# EasyEDA Pro project DreamFly.eprj, board PCB1
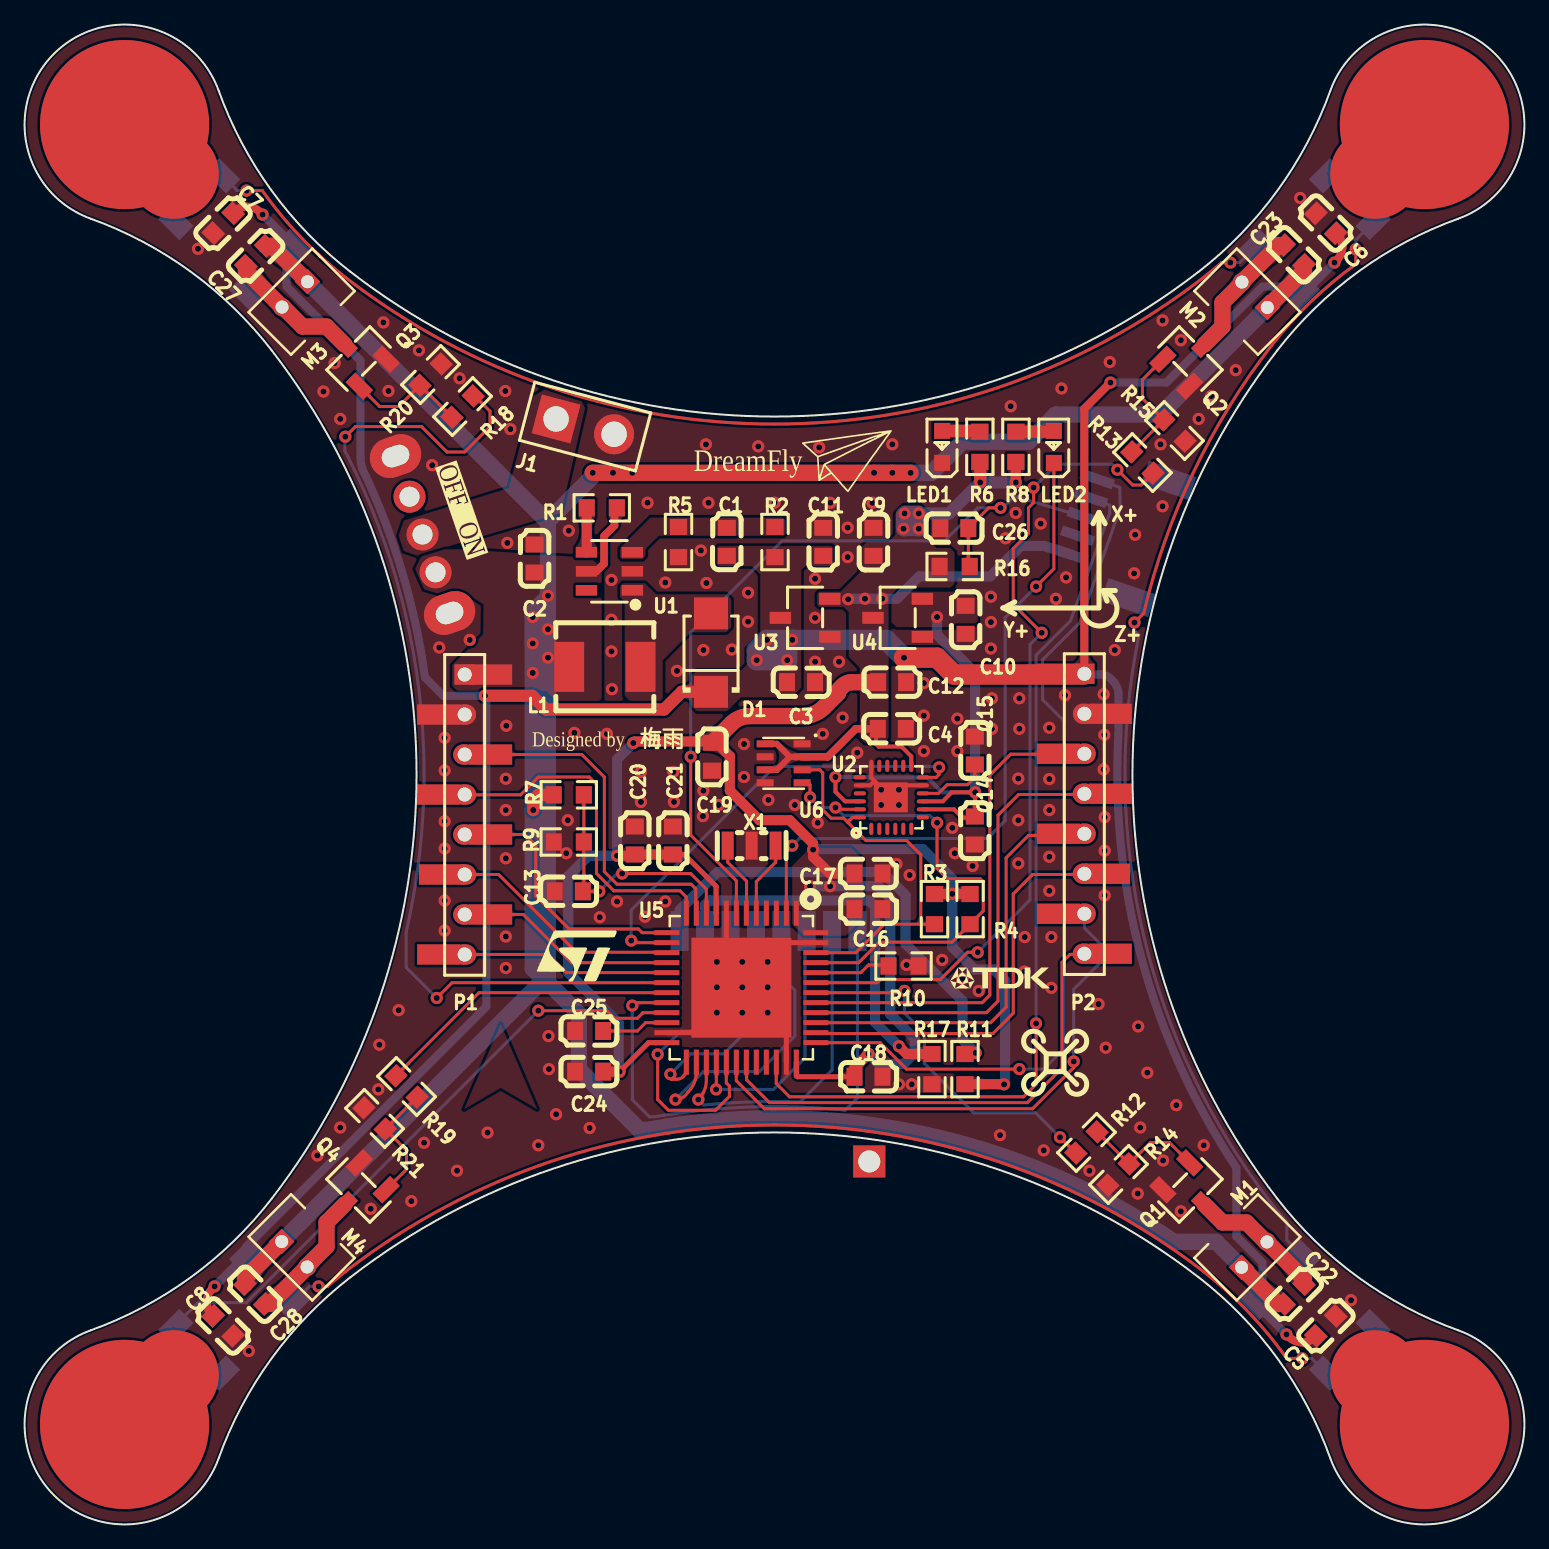
[diagram p4: board, top side]
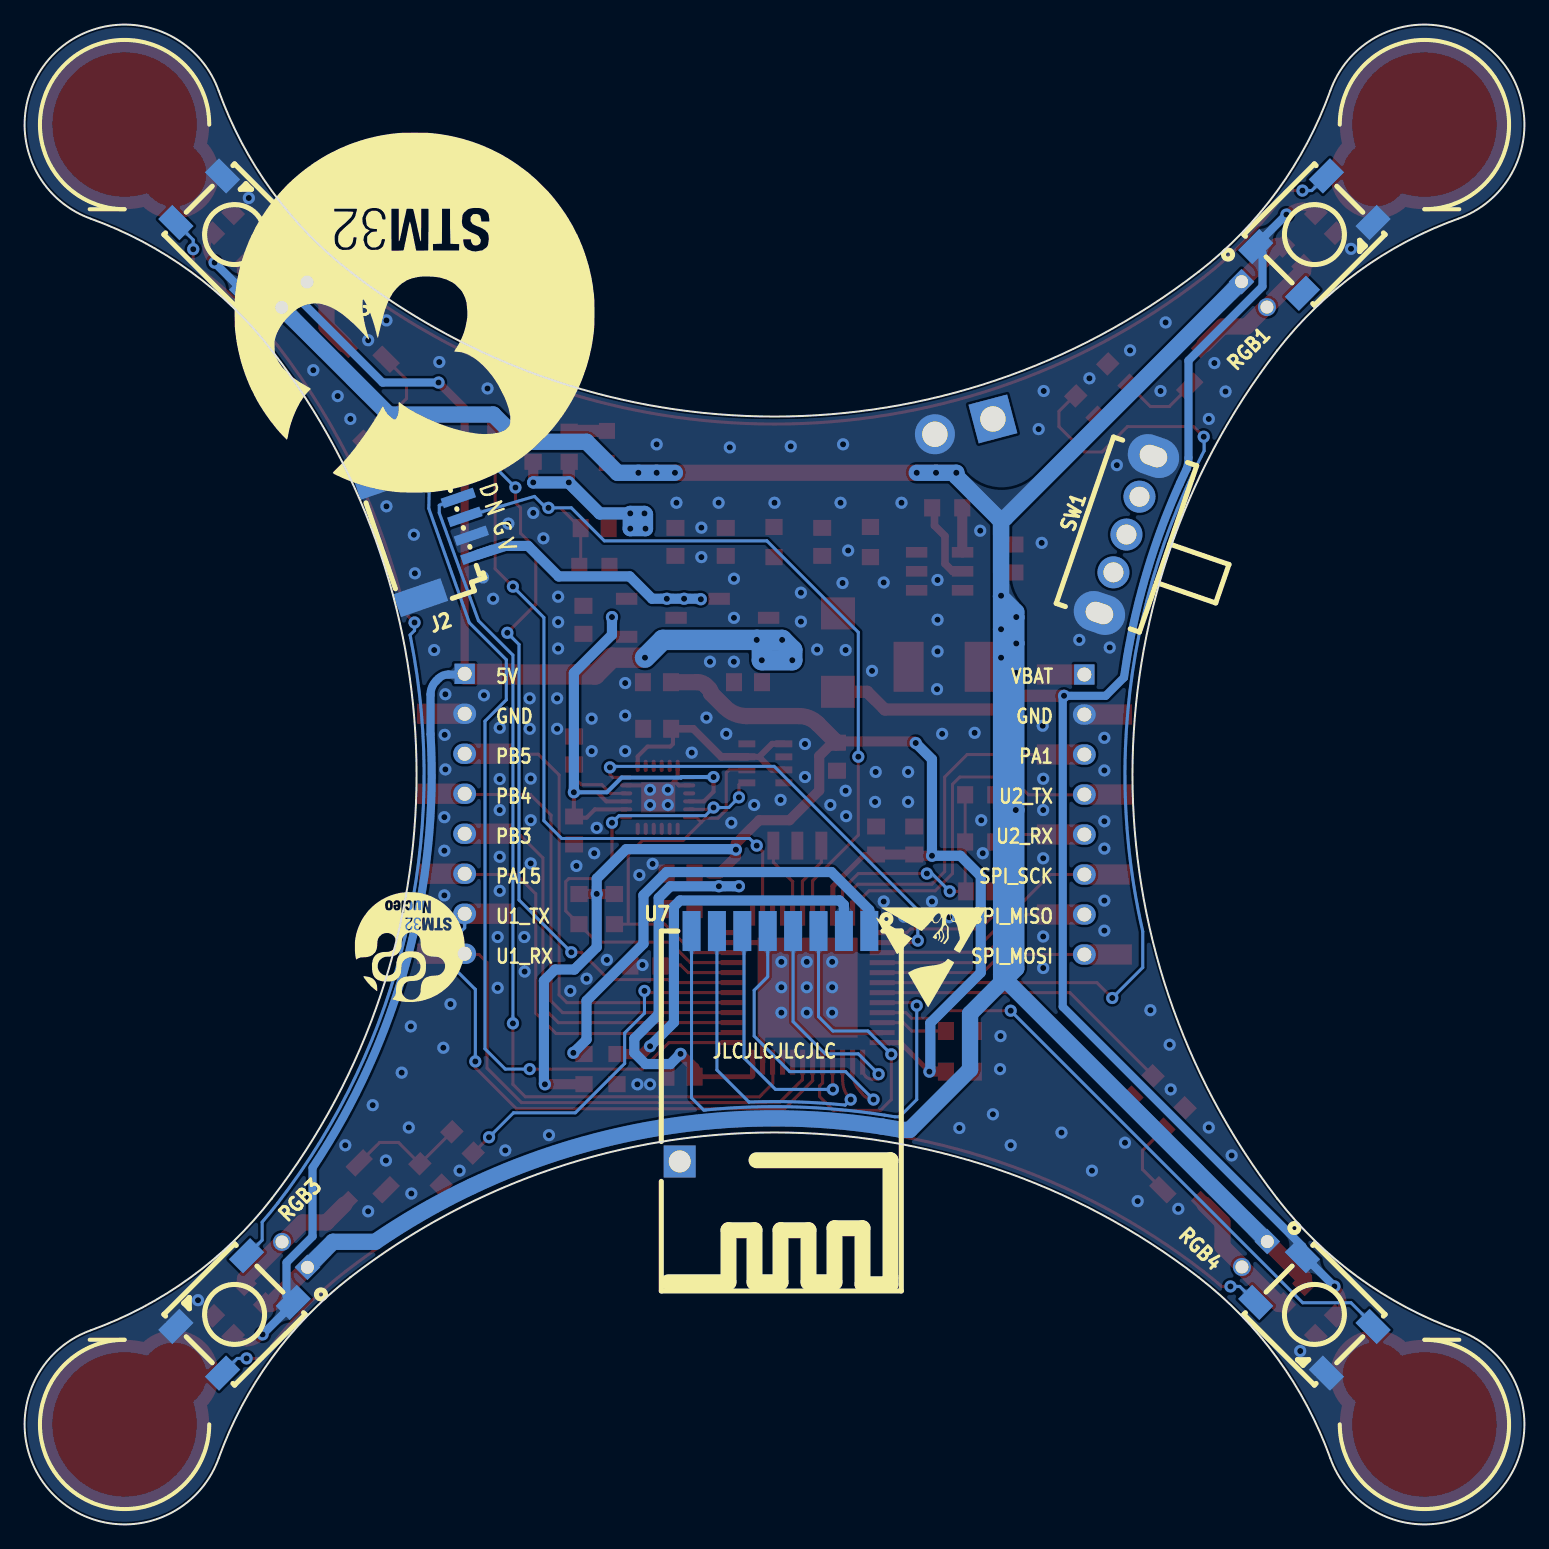
[diagram p5: board, bottom side, seen from below]

Outline 72.07 x 72.07 mm; copper layers: Top Layer, Bottom Layer. Coordinates in mm from the lower left corner of the outline.
Outline path: 1.84,63.83 arc(0,72.07) 8.24,70.23 arc(10.89,65.23) 14.83,61.18 arc(36.04,53.94) 57.24,61.18 arc(61.18,65.23) 63.83,70.23 arc(72.07,72.07) 70.23,63.83 arc(65.23,61.18) 61.18,57.24 arc(53.94,36.04) 61.18,14.83 arc(65.23,10.89) 70.23,8.24 arc(72.07,0) 63.83,1.84 arc(61.18,6.84) 57.24,10.9 arc(36.04,18.14) 14.83,10.9 arc(10.89,6.84) 8.24,1.84 arc(0,0) 1.84,8.24 arc(6.84,10.89) 10.9,14.83 arc(18.14,36.04) 10.9,57.24 arc(6.84,61.18) 1.84,63.83
Stack: Top Layer 0.035mm - / Dielectric1 1.51mm FR4 er 4.5 / Bottom Layer 0.035mm -

## Design rules (mm)
template: 自定义配置
spacing copperThickness1oz (default): track to track 0.102, other pairs 0 to 0.3
spacing copperThickness2oz: track to track 0.203, other pairs 0.152 to 0.3
track width copperThickness1oz (default): min 0.127, default 0.152, max 2.54
track width copperThickness2oz: min 0.203, default 0.254, max 2.54
differential pair differentialPair (default): width min 0.127, default 0.254, max 2.54; gap min 0.152, default 0.152
via viaSize (default): diameter min 0.5, default 0.61, max 10; hole min 0.3, default 0.305, max 6.299

## Placement (name value [footprint] x y rotation side)
C1  15pF  [C0603]  33.65 47.67 270 top
C2  22uF  [C0603]  24.04 46.84 270 top
C3  22uF  [C0603]  37.36 40.65 180 top
C4  100nF  [C0603]  41.9 38.32 0 top
C5  100nF  [C0603]  63.6 8.47 225 top
C6  100nF  [C0603]  63.6 63.6 315 top
C7  100nF  [C0603]  8.47 63.6 45 top
C8  100nF  [C0603]  8.47 8.47 135 top
C9  1uF  [C0603]  40.99 47.67 90 top
C10  1uF  [C0603]  45.59 43.77 270 top
C11  1uF  [C0603]  38.47 47.67 90 top
C12  1uF  [C0603]  41.92 40.65 0 top
C13  100nF  [C0603]  25.75 30.19 0 top
C14  100nF  [C0603]  46.05 33.24 90 top
C15  100nF  [C0603]  46.05 37.24 270 top
C16  100nF  [C0603]  40.73 29.3 180 top
C17  100nF  [C0603]  40.73 31.08 0 top
C18  100nF  [C0603]  40.73 20.92 180 top
C19  100nF  [C0603]  32.91 36.92 90 top
C20  4.7uF  [C0603]  29.05 32.73 90 top
C21  100nF  [C0603]  30.96 32.73 90 top
C22  100nF  [C0603]  62.02 10.05 225 top
C23  100nF  [C0603]  62.02 62.02 315 top
C24  100nF  [C0603]  26.76 21.18 0 top
C25  4.7uF  [C0603]  26.76 23.21 0 top
C26  100nF  [C0603]  45.03 48.35 0 top
C27  100nF  [C0603]  10.1 61.97 45 top
C28  100nF  [C0603]  10.05 10.05 135 top
D1  SS14F  [SMAF_L3.5-W2.6-LS4.7-RD]  32.86 42.13 90 top
J1  -  [BAT]  25.11 53.82 345.2 top
J2  SH1.0-5P_WT  [CONN-SMD_5P-P1.00_BX-SH1.0-5PWT]  53.13 48.37 251 bottom
L1  4.7uH  [IND-SMD_L4.9-W4.4_MAPM0420F]  27.55 41.42 0 top
LED1  NCD1608R1  [LED0603-RD_RED]  44.42 52.42 90 top
LED2  NCD1608A1  [LED0603-RD]  50.01 52.42 90 top
M1  720_MOTOR  [motor]  60.04 12.04 45 top
M2  720_MOTOR  [motor]  60.04 60.04 135 top
M3  720_MOTOR  [motor]  12.04 60.04 225 top
M4  720_MOTOR  [motor]  12.04 12.04 315 top
NOREF  -  [Pad_e109]  68.54 3.54 90 top
NOREF#2  -  [Pad_e112]  6 6 0 top
NOREF#3  -  [Pad_e114]  66.07 66.07 180 top
NOREF#4  -  [Pad_e107]  3.54 68.54 270 top
NOREF#5  -  [Pad_e111]  3.54 3.54 0 top
NOREF#6  -  [Pad_e113]  68.54 68.54 180 top
NOREF#7  -  [Pad_e108]  6 66.07 270 top
NOREF#8  -  [Pad_e110]  66.07 6 90 top
P1  -  [header10-2.0mm]  20.54 34.04 270 top
P2  -  [header10-2.0mm#2]  51.53 34.04 90 top
Q1  SI2302  [SOT-23-3_L2.9-W1.3-P1.90-LS2.4-BR]  56.84 15.24 135 top
Q2  SI2302  [SOT-23-3_L2.9-W1.3-P1.90-LS2.4-BR]  56.84 56.84 225 top
Q3  SI2302  [SOT-23-3_L2.9-W1.3-P1.90-LS2.4-BR]  15.24 56.84 315 top
Q4  SI2302  [SOT-23-3_L2.9-W1.3-P1.90-LS2.4-BR]  15.24 15.24 45 top
R1  100kΩ  [R0603]  27.4 49.37 0 top
R2  73.2kΩ  [R0603]  36.06 47.66 270 top
R3  10kΩ  [R0603]  44.04 29.3 90 top
R4  10kΩ  [R0603]  45.81 29.3 90 top
R5  10kΩ  [R0603]  31.24 47.66 90 top
R6  4.7kΩ  [R0603]  46.3 52.42 270 top
R7  100kΩ  [R0603]  25.75 35.02 0 top
R8  4.7kΩ  [R0603]  48.11 52.42 270 top
R9  100kΩ  [R0603]  25.75 32.66 180 top
R10  10kΩ  [R0603]  42.49 26.46 180 top
R11  0Ω  [R0603]  45.56 21.3 270 top
R12  100Ω  [R0603]  51.64 17.64 45 top
R13  100Ω  [R0603]  54.44 51.64 135 top
R14  10kΩ  [R0603]  53.24 16.04 45 top
R15  10kΩ  [R0603]  56.04 53.24 135 top
R16  10kΩ  [R0603]  45.04 46.44 180 top
R17  0Ω  [R0603]  43.91 21.3 90 top
R18  100Ω  [R0603]  20.44 54.44 225 top
R19  100Ω  [R0603]  17.64 20.44 315 top
R20  10kΩ  [R0603]  18.84 56.04 225 top
R21  10kΩ  [R0603]  16.04 18.84 315 top
RGB1  WS2812B  [LED-SMD_4P-L5.0-W5.0-BL_TC5050RGB]  9.04 63.04 135 bottom
RGB2  WS2812B  [LED-SMD_4P-L5.0-W5.0-BL_TC5050RGB]  63.04 63.04 45 bottom
RGB3  WS2812B  [LED-SMD_4P-L5.0-W5.0-BL_TC5050RGB]  63.04 9.04 315 bottom
RGB4  WS2812B  [LED-SMD_4P-L5.0-W5.0-BL_TC5050RGB]  9.04 9.04 225 bottom
SW1  SK12D07VG3  [SW-TH_SK12D07VG3]  18.44 48.04 109 bottom
U1  SX1308  [SOT-23-6_L2.9-W1.6-P0.95-LS2.8-BL]  27.78 46.2 90 top
U2  ICM20948  [qfn24-0.4]  41.88 34.89 90 top
U3  ME6206A33M3G  [SOT-23-3_L2.9-W1.6-P1.90-LS2.8-BR]  37.57 43.87 0 top
U4  XC6206P182MR  [SOT-23-3_L2.9-W1.6-P1.90-LS2.8-BR]  42.19 43.87 0 top
U5  STM32F411CEU6  [qfn48]  34.38 25.37 270 top
U6  BMP280  [LGA-2_5X2MM]  36.49 36.59 0 top
U7  2.4GHz  [WIRELM-SMD_AI-THINKER_NF-03]  36.04 22.45 0 bottom
X1  8MHz  [OSC-SMD_3P-L3.2-W1.3-P1.20-L]  34.89 32.48 180 top

## Footprints (pads in the part's own frame, mm; a bottom-side part is the same pattern mirrored in y, then rotated)
BAT
  rect 2x2 hole 1.27: 1(0,0)
  round 2 hole 1.27: 2(3,0)
C0603
  rect 0.8x0.9 smd: 1(-0.7,0) 2(0.7,0)
CONN-SMD_5P-P1.00_BX-SH1.0-5PWT
  rect 0.5x1.7 smd: 1(-2,1.7) 2(-1,1.7) 3(0,1.7) 4(1,1.7) 5(2,1.7)
  rect 1.2x2.5 smd: 6(3.1,-1.7) 7(-3.1,-1.7)
header10-2.0mm
  rect 1.016x2.159 smd: 1(-7,1.297) 2(-5,-1.297) 3(-2.999,1.297) 4(-1,-1.297) 5(1,1.297) 7(5,1.297) 8(7,-1.297)
  rect 1.016x1.016 hole 0.7: 1(-7,0)
  oval 1.016x1.143 hole 0.7: 2(-5,0) 3(-2.999,0) 4(-1,0) 5(1,0) 6(3.001,0) 7(5,0) 8(7,0)
  rect 1.016x2.286 smd: 6(3.001,-1.145)
header10-2.0mm#2
  rect 1.016x2.159 smd: 1(7.037,1.297) 2(5.037,-1.297) 3(3.037,1.297) 4(1.037,-1.297) 5(-0.963,1.297) 7(-4.963,1.297) 8(-6.963,-1.297)
  rect 1.016x1.016 hole 0.7: 1(7.037,0)
  oval 1.016x1.143 hole 0.7: 2(5.037,0) 3(3.037,0) 4(1.037,0) 5(-0.963,0) 6(-2.963,0) 7(-4.963,0) 8(-6.963,0)
  rect 1.016x2.286 smd: 6(-2.963,-1.145)
IND-SMD_L4.9-W4.4_MAPM0420F
  rect 1.5x2.5 smd: 1(-1.78,0) 2(1.78,0)
LED0603-RD
  rect 0.8x0.8 smd: 1(-0.799,0) 2(0.799,0)
LED0603-RD_RED
  rect 0.8x0.8 smd: 1(-0.799,-0.004) 2(0.799,0.004)
LED-SMD_4P-L5.0-W5.0-BL_TC5050RGB
  rect 1.5x1 smd: 1(-2.5,1.65) 2(-2.5,-1.65) 3(2.5,-1.65) 4(2.5,1.65)
LGA-2_5X2MM
  rect 0.85x0.35 smd: 1(0.925,0.975) 2(0.925,0.325) 3(0.925,-0.325) 4(0.925,-0.975) 5(-0.925,-0.975) 6(-0.925,-0.325) 7(-0.925,0.325) 8(-0.925,0.975)
motor
  rect 0.9x0.9 hole 0.65: 1(-0.911,0)
  round 0.9 hole 0.65: 2(0.886,0)
OSC-SMD_3P-L3.2-W1.3-P1.20-L
  rect 0.6x1.4 smd: 1(-1.199,0) 2(0,0) 3(1.199,0)
Pad_e107
  round 8.46 smd: 50(0,0)
Pad_e108
  round 4.5 smd: 1(0,0)
Pad_e109
  round 8.46 smd: 50(0,0)
Pad_e110
  round 4.5 smd: 1(0,0)
Pad_e111
  round 8.46 smd: 50(0,0)
Pad_e112
  round 4.5 smd: 1(0,0)
Pad_e113
  round 8.46 smd: 50(0,0)
Pad_e114
  round 4.5 smd: 1(0,0)
qfn24-0.4
  oval 0.61x0.203 smd: 1(-1.575,1) 2(-1.575,0.6) 3(-1.575,0.2) 4(-1.575,-0.2) 5(-1.575,-0.6) 6(-1.575,-1) 13(1.575,-1) 14(1.575,-0.6) 15(1.575,-0.2) 16(1.575,0.2) 17(1.575,0.6) 18(1.575,1)
  oval 0.203x0.61 smd: 7(-1,-1.575) 8(-0.6,-1.575) 9(-0.2,-1.575) 10(0.2,-1.575) 11(0.6,-1.575) 12(1,-1.575) 19(1,1.575) 20(0.6,1.575) 21(0.2,1.575) 22(-0.2,1.575) 23(-0.6,1.575) 24(-1,1.575)
  rect 1.5x1.7 smd: 25(0,0.025)
qfn48
  rect 1.25x0.25 smd: 1(-3.734,2.743) 2(-3.734,2.243) 3(-3.734,1.743) 4(-3.734,1.243) 5(-3.734,0.743) 6(-3.734,0.243) 7(-3.734,-0.257) 8(-3.734,-0.757) 9(-3.734,-1.257) 10(-3.734,-1.757) 11(-3.734,-2.257) 12(-3.734,-2.757) 25(3.716,-2.757) 26(3.716,-2.257) 27(3.716,-1.757) 28(3.716,-1.257) 29(3.716,-0.757) 30(3.716,-0.257) 31(3.716,0.243) 32(3.716,0.743) 33(3.716,1.243) 34(3.716,1.743) 35(3.716,2.243) 36(3.716,2.743)
  rect 0.25x1.25 smd: 13(-2.759,-3.732) 14(-2.259,-3.732) 15(-1.759,-3.732) 16(-1.259,-3.732) 17(-0.759,-3.732) 18(-0.259,-3.732) 19(0.241,-3.732) 20(0.741,-3.732) 21(1.241,-3.732) 22(1.741,-3.732) 23(2.241,-3.732) 24(2.741,-3.732) 37(2.741,3.718) 38(2.241,3.718) 39(1.741,3.718) 40(1.241,3.718) 41(0.741,3.718) 42(0.241,3.718) 43(-0.259,3.718) 44(-0.759,3.718) 45(-1.259,3.718) 46(-1.759,3.718) 47(-2.259,3.718) 48(-2.759,3.718)
  rect 5x5 smd: 49(-0.009,-0.007)
R0603
  rect 0.806x0.864 smd: 1(-0.753,0) 2(0.753,0)
SMAF_L3.5-W2.6-LS4.7-RD
  rect 1.6x1.7 smd: 1(-1.96,0) 2(1.96,0)
SOT-23-3_L2.9-W1.3-P1.90-LS2.4-BR
  rect 1.25x0.7 smd: 1(1,-0.95) 2(1,0.95) 3(-1,0)
SOT-23-3_L2.9-W1.6-P1.90-LS2.8-BR
  rect 1.07x0.6 smd: 1(1.235,-0.95) 2(1.235,0.95) 3(-1.235,0)
SOT-23-6_L2.9-W1.6-P0.95-LS2.8-BL
  rect 0.532x1.072 smd: 1(-0.95,-1.149) 2(0,-1.149) 3(0.95,-1.149) 4(0.95,1.149) 5(0,1.149) 6(-0.95,1.149)
SW-TH_SK12D07VG3
  oval 1.6x1.6 hole 1: 1(-2,0) 2(0,0) 3(2,0)
  oval 2x2.6 hole 1x1.4: 4(4.15,0) 5(-4.15,0)
WIRELM-SMD_AI-THINKER_NF-03
  rect 0.9x2 smd: 1(-4.74,-5.761) 2(-3.47,-5.761) 3(-2.2,-5.761) 4(-0.93,-5.761) 5(0.34,-5.761) 6(1.609,-5.761) 7(2.88,-5.761) 8(4.149,-5.761)
  rect 1.6x1.6 hole 1.1: 9(4.74,5.761)

## Nets
As in the schematic.

Pads without a net: NOREF 50; NOREF#2 1; NOREF#3 1; NOREF#4 50; NOREF#5 50; NOREF#6 50; NOREF#7 1; NOREF#8 1; RGB1 2; SW1 3; U1 6; U2 1 2 3 4 5 6 7 14 15 16 17 19 21; U5 3 4 32 33; U7 9

## Via types
v1: diameter 0.61, hole 0.305, Top Layer to Bottom Layer, 263 vias

## Routing (per net, layer and track width the routed paths; a pad name or vN(x,y) marks a point on that pad's centre or on a via; arc(x,y) is an arc through that point)
1V8: length 25.8
  Top Layer w0.203: U2.22 39.57,34.69 39.08,35.18 v1(39.08,35.91) ; U2.8 45.02,34.29 45.43,33.88 46,33.88 C14.2 46.07,33.95 v1(46.07,35.15) 44.9,35.15 44.45,34.69 U2.9
  Bottom Layer w0.203: v1(46.07,35.15) 44.42,35.15 43.68,35.88 40.71,35.88 40.68,35.91 v1(39.08,35.91)
  Bottom Layer w0.508: v1(44.16,43.91) 44.16,43.02 46.07,41.12 v1(46.07,35.15)
3V3: length 132
  Top Layer w0.203: 41.05,38.32 41.12,38.26 41.12,37.56 41.24,37.43 42.39,37.43 42.88,36.94 U2.13
  Top Layer w0.254: C18.2 37.18,20.92 37.13,20.97 U5.36 ; C21.1 31.53,32.03 33.11,30.45 33.11,29.11 U5.9 ; U5.24 29.74,22.63 v1(28.29,21.18)
  Top Layer w0.305: 36.8,36.92 36.15,36.27 35.54,36.27 ; 36.8,36.92 37.39,36.92 ; 36.8,36.92 36.15,37.57 35.54,37.57
  Top Layer w0.381: 37.39,36.92 38.7,36.92 40.1,38.32 41.05,38.32
  Top Layer w0.508: v1(28.16,31.97) 28.99,31.97 C20.1 C21.1 ; v1(28.97,37.61) 29.05,37.69 32.8,37.69 32.86,37.62 33.13,37.62 33.8,36.96 33.8,35.24 35.29,33.75 36.8,33.75 37.97,32.58 v1(37.97,32.28) 37.97,31.92 38.8,31.08 39.27,31.08 ; C24.2 v1(28.29,21.18) ; v1(47.52,20.54) 47.51,20.55 R11.2 ; R4.2 45.81,30.07 v1(44.93,30.07) 44.92,30.06 43.91,30.06 ; v1(40.73,22.07) 40.03,21.37 C18.2 ; v1(48.1,50.64) 48.1,51.66 R8.2
  Top Layer w0.61: R6.2 46.32,51.65 v1(46.32,50.64)
  Top Layer w0.813: 41.06,40.65 39.88,40.65 arc(39.65,40.61) 39.46,40.48 39.3,40.32 arc(39.23,40.22) 39.21,40.1 38.52,39.41 arc(38.02,39.07) 37.43,38.96 34.8,38.96 arc(34.3,38.86) 33.88,38.58 33.03,37.73 arc(32.99,37.68) 32.94,37.62
  Bottom Layer w0.508: v1(37.97,32.28) 37.99,32.3 43.45,32.3 44.93,30.83 v1(44.93,30.07) 44.93,27.4 46.04,26.28 47.01,26.28 47.57,25.72 47.57,20.59 v1(47.52,20.54) ; v1(28.97,37.61) 28.16,36.8 v1(28.16,31.97) 26.74,31.97 25.72,30.96 25.72,26.13 28.24,23.61 28.24,21.22 v1(28.29,21.18) ; v1(37.81,30.45) v1(38.82,30.45) 41.24,30.45 41.83,29.86 41.83,24.05 43.05,22.83 43.05,22.12 42.49,21.56 41.24,21.56 v1(40.73,22.07) ; J2.5 49.5,47.47 48.35,47.47 46.83,45.94 43.27,45.94 42.16,44.82 v1(41.42,44.82) v1(40.56,44.82) 39.74,44.82 v1(39.72,44.8)
  Bottom Layer w0.61: v1(43.25,49.09) 44.77,49.09 v1(46.32,50.64) v1(48.1,50.64)
  Bottom Layer w0.762: v1(42.54,49.09) v1(43.25,49.09) v1(43.25,48.33) v1(42.49,48.33) 42.49,49.04 v1(42.54,49.09)
5V: length 169.7
  Top Layer w0.406: v1(61.64,8.04) 61.75,7.92 arc(62.07,7.71) 62.44,7.64 arc(62.75,7.7) 63.01,7.87 C5.2 ; 51.53,41.04 51.53,54.33 v1(52.84,55.64) ; v1(8.04,10.44) 7.92,10.32 arc(7.71,10.01) 7.64,9.64 arc(7.7,9.32) 7.87,9.06 C8.2 ; C6.2 64.2,63.01 arc(64.37,62.75) 64.44,62.44 arc(64.36,62.07) 64.15,61.75 v1(64.04,61.64) ; v1(10.44,64.04) 10.32,64.15 arc(10.01,64.36) 9.64,64.44 arc(9.32,64.37) 9.06,64.2 C7.2
  Top Layer w0.61: v1(21.56,39.97) 23.92,39.97 24.61,39.29 30.52,39.29 31.4,40.17 D1.1
  Top Layer w1.016: v1(42.51,41.88) 44.16,41.88 45.01,41.04 51.53,41.04
  Bottom Layer w0.406: 51.53,41.04 52.35,41.04 arc(52.61,40.98) 52.84,40.84 52.95,40.72 arc(53.16,40.41) 53.24,40.04 53.24,38.06 arc(54.42,26.73) 59.14,16.37 59.14,12.94 60.44,11.64 60.44,9.97 60.1,9.64 arc(60.11,9.58) 60.15,9.52 v1(61.64,8.04) ; v1(52.84,55.64) 55.64,55.64 60.44,60.44 62.1,60.44 62.43,60.1 arc(62.5,60.11) 62.55,60.15 v1(64.04,61.64) ; v1(10.44,64.04) 11.92,62.55 arc(11.96,62.5) 11.97,62.43 11.64,62.1 11.64,60.44 15.33,56.74 15.33,51.87 arc(15.36,51.6) 15.42,51.34 arc(15.59,50.97) 15.76,50.6 arc(17.36,46.33) 18.41,41.88 arc(18.49,41.38) 18.56,40.89 19.47,39.97 v1(21.56,39.97) 21.62,39.91 21.62,24.42 9.64,12.44 9.64,11.97 arc(9.58,11.96) 9.52,11.92 v1(8.04,10.44)
  Bottom Layer w1.016: v1(36.92,42.77) 41.62,42.77 v1(42.51,41.88) ; v1(36.92,42.77) v1(35.65,42.77) 35.15,42.26 v1(35.15,41.75) v1(36.67,41.75) 36.67,42.51 v1(36.92,42.77)
GND: length 22.7
  Top Layer w0.203: U2.20 40.82,35.49 41.04,35.71 ; U2.18 40.88,35.87 41.04,35.71 ; 41.04,35.71 U2.25 42.45,35.49 U2.11
  Top Layer w0.254: U5.49 36.63,27.63 38.1,27.63 ; U5.49 36.63,23.13 U5.35 ; U5.49 32.13,23.13 U5.23 ; U5.49 33.63,26.13 U5.8
  vias: v1(7.21,62.32) v1(9.75,7.21) v1(13.18,16.99) v1(13.48,55.19) v1(14.04,56.61) v1(14.32,53.82) v1(14.32,18.38) v1(15.84,14.32) v1(16.27,22.52) v1(16.22,20.29) v1(16.48,58.64) v1(16.73,55.21) v1(17.24,24.25) v1(17.87,14.7) v1(18.26,57.24) v1(18.51,17.62) v1(18.92,51.5) v1(19.27,42.39) v1(19.54,37.87) v1(19.54,36.24) v1(19.54,33.7) v1(19.54,32.33) v1(19.54,29.73) v1(19.54,28.23) v1(20.16,16.22) v1(20.29,55.85) v1(20.8,42.77) v1(21.68,18.13) v1(22.57,55.21) v1(22.68,47.62) v1(22.62,38.47) v1(22.6,35.82) v1(22.6,34.26) v1(22.6,31.84) v1(22.6,27.93) v1(22.6,26.36) v1(22.83,53.31) v1(24.22,17.49) v1(24.73,22.95) v1(24.76,21.3) v1(25.11,19.05) v1(25.62,32.1) v1(25.75,48.23) v1(25.7,33.75) v1(26.03,38.12) v1(26.79,18.36) v1(27.3,28.9) v1(27.65,38.07) v1(27.88,45.76) v1(27.88,43.77) v1(27.88,42.19) v1(27.91,40.3) v1(28.16,29.69) v1(29.36,36.16) v1(29.36,34.66) v1(29.56,28.92) v1(29.69,49.62) v1(30.57,45.64) v1(30.57,29.69) v1(30.98,36.16) v1(31.01,34.66) v1(31.16,41.22) v1(32.35,47.24) v1(32.48,42.26) v1(32.48,35.22) v1(32.45,33.95) v1(32.61,52.55) v1(32.63,45.61) v1(32.73,49.62) v1(33.15,26.67) v1(33.15,25.4) v1(33.15,24.13) v1(33.24,34.51) v1(33.9,42.28) v1(34.42,26.67) v1(34.42,25.4) v1(34.42,24.13) v1(34.51,37.56) v1(34.51,35.91) v1(34.71,45.13) v1(34.71,43.68) v1(35.22,52.44) v1(35.73,34.77) v1(35.69,26.67) v1(35.69,25.4) v1(35.69,24.13) v1(36.04,49.62) v1(37.05,34.51) v1(38.06,45.83) v1(38.06,43.87) v1(38.07,41.67) v1(38.27,52.39) v1(38.19,33.62) v1(38.45,38.07) v1(38.83,49.62) v1(39.26,41.67) v1(39.44,38.88) v1(39.69,48.38) v1(39.69,46.91) v1(40.18,37.13) v1(40.94,49.62) v1(41.37,35.27) v1(41.37,34.51) v1(41.93,52.55) v1(42.13,31.57) v1(42.26,35.27) v1(42.26,34.51) v1(42.26,20.54) v1(42.64,26.51) v1(42.79,31.01) v1(42.89,20.54) v1(43.5,40.61) v1(43.5,38.98) v1(43.5,37.2) v1(44.42,26.76) v1(44.93,33.37) v1(45.05,32.1) v1(45.18,38.83) v1(45.18,37.2) v1(45.43,25.82) v1(45.94,31.46) v1(46.25,25.22) v1(46.86,44.93) v1(46.86,43.66) v1(46.86,42.33) v1(46.91,39.85) v1(46.91,38.32) v1(47.31,18) v1(47.59,47.85) v1(47.85,54.45) v1(48.1,49.12) v1(48.28,39.85) v1(48.28,38.32) v1(48.23,35.83) v1(48.23,33.75) v1(48.23,31.59) v1(48.55,27.91) v1(48.53,26.18) v1(49.35,48.58) v1(49.5,17.24) v1(49.78,38.37) v1(49.78,35.81) v1(49.78,34.26) v1(49.78,31.92) v1(49.78,30.22) v1(49.88,27.91) v1(49.88,25.37) v1(50.11,44.82) v1(50.39,55.34) v1(50.56,40) v1(50.62,45.89) v1(51.78,16.22) v1(52.24,24.55) v1(52.49,40.05) v1(52.53,38.02) v1(52.49,36.29) v1(52.55,33.9) v1(52.55,32.23) v1(52.55,29.99) v1(52.6,22.37) v1(52.8,56.66) v1(53.05,42.26) v1(54.07,48.02) v1(54.02,46.09) v1(54.22,23.44) v1(54.2,15.08) v1(54.32,18.38) v1(54.68,21.13) v1(55.34,52.55) v1(55.44,58.74) v1(55.44,49.45) v1(55.47,16.73) v1(56.13,19.5) v1(56.36,57.75) v1(56.36,14.19) v1(57.24,53.82) v1(57.5,17.49) v1(57.88,54.96) v1(59.1,56.25) v1(62.32,64.86) v1(64.86,9.75)
VBAT: length 182.2
  Top Layer w0.381: R1.2 28.03,49.25 28.03,48.48 27.51,47.96 27.51,46.58 27.13,46.2 U1.5
  Top Layer w0.61: R7.1 24.22,35.02 23.97,34.77 v1(23.97,34.26)
  Top Layer w0.813: C23.2 62.51,61.23 M2.1 ; M4.1 9.56,10.85 C28.2 ; M3.1 10.89,62.47 C27.2 ; v1(26.94,51.12) v1(27.96,51.12) v1(28.92,51.12) v1(41.01,51.12) v1(41.93,51.12) v1(42.84,51.12) ; M1.1 61.23,9.56 C22.2
  Bottom Layer w0.813: 24.7,26.04 24.5,26.04 24.5,25.79 ; 24.7,26.04 24.7,25.62 26.26,24.07 26.26,21.29 29.28,18.26 29.67,18.26 arc(30.15,18.35) 30.62,18.42 arc(41.13,18.47) 51.19,15.43 arc(53.65,14.14) 56.01,12.67 58.12,12.67 M1.1 ; 24.7,26.04 24.7,34.26 v1(23.97,34.26) ; 24.71,44.93 v1(24.71,43.3) v1(24.71,41.88) 24.71,34.32 ; 24.71,44.93 23.95,44.17 v1(23.95,43.91) 23.94,43.91 23.94,42.59 v1(23.95,42.59) v1(23.95,41.12) 23.95,34.28 v1(23.97,34.26) ; 24.71,44.93 v1(24.71,44.98) 24.71,48.78 24.76,48.83 arc(24.76,48.85) 24.77,48.86 ; 24.77,48.86 24.86,48.86 26.94,50.95 v1(26.94,51.12) v1(27.96,51.12) v1(28.92,51.12) ; 24.77,48.86 24.5,48.86 M3.1 ; 24.5,25.79 23.95,26.34 23.95,34.23 v1(23.97,34.26) ; 24.5,25.79 M4.1 ; v1(41.01,51.12) v1(41.93,51.12) v1(42.84,51.12) 43.88,51.12 45.43,52.67 48.74,52.67 50.1,54.04 55.32,54.04 M2.1
VBAT_TST: length 12.9
  Top Layer w0.152: U5.10 32.63,30.3 31.84,31.08 v1(28.42,31.08) ; R7.2 R9.1 26.5,30.25 C13.2 v1(27.27,30.19)
  Bottom Layer w0.152: v1(28.42,31.08) 28.16,31.08 v1(27.27,30.19)
IMU_INT: length 23
  Top Layer w0.152: v1(44.27,36.39) 44.27,36.04 44.12,35.89 U2.12 ; v1(28.87,27.73) 28.97,27.63 U5.14
  Bottom Layer w0.152: v1(44.27,36.39) 44.21,36.44 36.05,36.44 28.87,29.26 v1(28.87,27.73)
IMU_SCL: length 25
  Top Layer w0.152: 38.1,26.63 40.24,26.63 41.27,27.65 44.92,27.65 R4.1 46.48,29.21 46.48,30.68 46.32,30.83 44.67,30.83 44.16,31.34 v1(44.16,33.62) ; v1(37.81,34.89) 37.81,35.53 37.72,35.62 37.39,35.62 ; v1(39.08,34.38) 39.18,34.29 U2.23
  Bottom Layer w0.152: v1(37.81,34.89) 38.32,34.38 v1(39.08,34.38) 39.49,33.98 43.81,33.98 v1(44.16,33.62)
IMU_SDA: length 19.5
  Top Layer w0.152: 37.37,36.27 38.3,36.27 38.45,36.12 38.45,34.27 38.86,33.85 39.49,33.85 39.69,33.65 ; 39.69,33.65 39.94,33.89 U2.24 ; 39.69,33.65 40.61,32.73 42.64,32.73 43.35,32.02 43.35,28.58 ; 43.91,28.55 41.53,28.55 40.1,27.13 37.98,27.13
MOTOR1: length 17.9
  Top Layer w0.152: 50.31,17.9 v1(50.31,17.9) R12.1 ; v1(42.54,25.22) 42.45,25.13 38.1,25.13
  Bottom Layer w0.152: v1(50.31,17.9) 49.09,19.12 45.99,19.12 43.53,21.58 43.53,23.11 42.54,24.1 v1(42.54,25.22)
MOTOR2: length 41.4
  Top Layer w0.152: v1(48.99,50.39) 48.99,49.62 48.74,49.37 48.74,48.1 47.97,47.34 47.97,44.54 v1(49.4,43.12) ; v1(53.18,51.28) 53.94,50.51 54.38,50.51 R13.1 ; v1(46.2,27.15) 45.69,27.15 44.32,25.78 41.32,25.78 41.17,25.63 38.1,25.63 ; 37.98,25.63 37.98,25.62
  Bottom Layer w0.152: v1(53.18,51.28) 52.9,51.55 50.15,51.55 v1(48.99,50.39) ; v1(46.2,27.15) 48.81,29.76 48.81,42.54 v1(49.4,43.12)
MOTOR3: length 51.5
  Top Layer w0.152: R18.1 21.04,54.97 21.81,54.2 21.81,53.43 20.54,52.16 19.65,52.16 18.38,53.43 15.08,53.43 v1(14.57,52.93) ; 30.53,25.63 19.91,25.63 v1(19.14,24.86)
  Bottom Layer w0.152: v1(14.57,52.93) 14.55,52.91 14.55,52.22 arc(14.62,52.09) 14.68,51.97 arc(17.38,44.86) 18.49,37.34 arc(18.36,32.73) 17.62,28.18 17.62,26.38 v1(19.14,24.86)
MOTOR4: length 15.3
  Top Layer w0.152: U5.19 21.26,25.13 R19.1
NRF_CE: length 16.7
  Top Layer w0.152: v1(30.19,22.04) 30.19,19.78 30.73,19.25 33.09,19.25 33.78,19.94 33.78,20.46 33.63,20.61 U5.29
  Bottom Layer w0.152: v1(30.19,22.04) 31.36,23.21 33.11,23.21 33.84,23.93 33.84,28.08
NRF_CSN: length 11.4
  Top Layer w0.152: U5.25 31.63,21.32 arc(31.59,21.1) 31.46,20.92 arc(31.32,20.83) 31.16,20.8 30.88,20.8 arc(30.82,20.92) v1(30.83,21.05)
  Bottom Layer w0.152: 35.11,28.08 35.11,23.68 33.5,22.07 31.84,22.07 v1(30.83,21.05)
NRF_IRQ: length 26.6
  Top Layer w0.152: v1(28.92,24.48) 29.07,24.63 30.53,24.63
  Bottom Layer w0.152: U7.8 40.19,19.87 39.57,19.25 arc(39.52,19.26) 39.48,19.26 arc(35,19.41) 30.53,19 arc(30.27,18.96) 30.02,18.92 29.78,18.92 28.92,19.78 v1(28.92,24.48)
NRF_MISO: length 16.4
  Top Layer w0.152: U5.27 32.63,20.75 arc(32.52,20.23) v1(32.23,19.78)
  Bottom Layer w0.152: 37.31,19.66 38.92,21.26 U7.7 ; 37.31,19.66 arc(37.31,19.66) 37.31,19.66 ; 37.31,19.66 arc(37.31,19.66) 37.31,19.66 ; v1(32.23,19.78) 32.5,19.51 arc(34.9,19.66) 37.31,19.66
NRF_MOSI: length 13.1
  Top Layer w0.152: U5.28 33.13,20.31 ; 33.13,20.31 33.13,20.28 ; 33.13,20.31 arc(33.12,20.3) v1(33.11,20.29) ; 33.13,20.31 arc(33.14,20.29) 33.13,20.28 ; 33.13,20.28 33.13,20.18 arc(33.15,20.23) 33.13,20.28
  Bottom Layer w0.152: v1(33.11,20.29) 35.98,20.29 37.56,21.86 37.56,28.12 U7.6
NRF_SCK: length 15.1
  Top Layer w0.152: U5.26 32.13,21.15 arc(32.02,20.62) 31.72,20.16 31.7,20.14 arc(31.44,19.88) v1(31.08,19.78)
  Bottom Layer w0.152: 36.38,28.08 36.38,25.92 37.05,25.24 37.05,22.95 35.27,21.18 32.48,21.18 v1(31.08,19.78)
NRST: length 41.6
  Top Layer w0.152: R16.1 45.73,46.51 C26.2 46.74,49.37 v1(47.34,49.37) ; U5.7 34.13,30.72 31.84,33.01 v1(31.84,36.92)
  Bottom Layer w0.152: J2.3 48.04,49.94 47.47,49.37 v1(47.34,49.37) 46.2,49.37 44.54,47.72 36.42,47.72 31.84,43.15 v1(31.84,36.92)
OSC_I: length 3.8
  Top Layer w0.152: U5.5 35.13,30.68 36.09,31.65 X1.1
OSC_O: length 3.8
  Top Layer w0.152: U5.6 34.64,29.11 34.64,30.7 33.69,31.65 X1.3
PA1: length 18.3
  Top Layer w0.152: P1.3 P1.3 26.4,37.04 27.53,35.91 27.53,31.18 28.16,30.55 31.87,30.55 32.1,30.32 32.1,29.13 U5.11
PA15: length 20.2
  Top Layer w0.152: 38.1,23.13 38.15,23.08 46.96,23.08 47.97,24.1 47.97,30.07 48.94,31.04 51.53,31.04
PB3: length 21.7
  Top Layer w0.152: 38.1,23.63 46.84,23.63 47.62,24.4 47.62,31.87 48.74,32.99 51.48,32.99 51.53,33.04
PB4: length 23.4
  Top Layer w0.152: 51.53,35.04 48.24,35.04 47.21,34 47.21,24.71 46.63,24.13 38.1,24.13
PB5: length 25
  Top Layer w0.152: 51.53,37.04 51.51,37.05 47.85,37.05 46.81,36.01 46.81,25.01 46.42,24.63 38.1,24.63
RGB_LED: length 31.3
  Top Layer w0.152: v1(24.22,24.22) 27.65,24.22 28.03,23.84 29.18,23.84 29.46,24.13 30.53,24.13
  Bottom Layer w0.152: v1(24.22,24.22) 9.62,9.62 7.21,9.62 6.1,8.51 6.1,8.43
SPI_MISO: length 11.1
  Top Layer w0.152: U5.16 25.89,26.63 23.48,29.04 P1.7 P1.7
SPI_MOSI: length 10.5
  Top Layer w0.152: U5.17 30.65,26.13 25.62,26.13 24.72,27.04 P1.8
SPI_SCK: length 11.7
  Top Layer w0.152: U5.15 30.63,27.15 26.13,27.15 22.24,31.04 P1.6
SWCLK: length 44.2
  Top Layer w0.152: 38.1,22.63 41.32,22.63 42.64,21.3 v1(48.28,21.3)
  Bottom Layer w0.152: J2.1 53.3,50.39 53.32,49.34 51.3,43.63 49.45,41.78 49.45,39.77 50.51,38.7 50.51,22.32 49.5,21.3 v1(48.28,21.3)
SWDIO: length 45.6
  Top Layer w0.152: v1(49.12,23.59) 49.12,20.54 48.49,19.92 36.79,19.92 36.12,20.58 36.12,21.65 U5.34
  Bottom Layer w0.152: J2.2 52.8,49.5 52.8,49.12 50.84,43.73 49.12,42 v1(49.12,23.59)
U1_RX: length 24.4
  Top Layer w0.152: 51.53,27.04 50.81,27.04 50.41,26.64 50.41,21.35 48.68,19.63 35.78,19.63 34.64,20.77 34.64,21.64 U5.31
U1_TX: length 27.8
  Top Layer w0.152: v1(51,21.69) 51,21.38 48.94,19.32 35.53,19.32 34.13,20.72 U5.30
  Bottom Layer w0.152: v1(51,21.69) 51,25.29 52.34,26.64 52.34,27.55 51.53,28.36 P2.7
U2_RX: length 13.6
  Top Layer w0.152: U5.13 29.42,28.13 29.23,28.31 25.76,28.31 24.1,29.97 24.1,32.48 23.54,33.04 P1.5 P1.5
U2_TX: length 17.4
  Top Layer w0.152: P1.4 20.56,35.02 23.34,35.02 24.22,35.91 26.77,35.91 27.13,35.55 27.13,31.09 28,30.22 31.31,30.22 31.63,29.9 U5.12
USER_LED: length 33.6
  Top Layer w0.152: v1(36.92,32.48) 36.63,32.18 U5.2 ; v1(49.12,45.43) 50.01,46.32 LED2.1
  Bottom Layer w0.152: v1(49.12,45.43) 47.57,43.88 47.57,33.72 46.68,32.84 37.28,32.84 v1(36.92,32.48)
$1N4534: length 3.6
  Top Layer w0.152: 27.21,23.21 29.18,23.21 29.6,23.63 U5.22
$1N4588: length 3.6
  Top Layer w0.152: U2.10 44.24,35.09 44.67,35.53 45.69,35.53 46.05,35.89 C15.2
$1N4610: length 19.4
  Top Layer w0.508: v1(42.26,22.45) 42.65,22.06 R17.2
  Bottom Layer w0.508: v1(42.26,22.45) 41.06,23.64 41.06,29.43 40.76,29.74 32.78,29.74 32.57,29.52 32.57,28.08
$1N4612: length 23.6
  Top Layer w0.508: R11.1 46.03,22.06 v1(46.09,22.12)
  Bottom Layer w0.508: 31.3,28.08 31.3,29.26 33.19,31.16 41.43,31.16 42.59,30 42.59,27.57 45.43,24.72 45.43,22.78 v1(46.09,22.12)
$1N4623: length 2.2
  Top Layer w0.508: R1.1 26.65,47.16 U1.4
$1N4636: length 1.9
  Top Layer w0.61: R6.1 46.26,53.22 LED1.2
$1N4641: length 6.2
  Top Layer w0.152: 56.8,16.61 55.78,17.64 54.84,17.64 R14.2 R12.2
$1N4654: length 6.8
  Top Layer w0.813: C22.1 62.51,10.81 M1.2 60.61,12.66 59.64,13.64 58.44,13.64 Q1.3
$1N4655: length 6.8
  Top Layer w0.813: C23.1 61.26,62.51 M2.2 59.41,60.61 58.44,59.64 58.44,58.44 Q2.3
$1N4656: length 6.7
  Top Layer w0.813: C27.1 9.6,61.22 M3.2 11.46,59.41 12.44,58.44 13.64,58.44 Q3.3
$1N4657: length 6.2
  Top Layer w0.152: 55.46,56.8 54.44,55.78 54.44,54.84 R15.2 R13.2
$1N4658: length 6.2
  Top Layer w0.152: R19.2 R21.2 17.64,17.24 17.64,16.29 16.61,15.27
$1N4659: length 6.2
  Top Layer w0.152: R18.2 R20.2 17.24,54.44 16.29,54.44 15.27,55.46
$1N4660: length 6.8
  Top Layer w0.813: Q4.3 13.64,13.64 13.64,12.44 12.66,11.46 M4.2 10.81,9.56 C28.1
$1N4662: length 1.9
  Top Layer w0.61: R8.1 49.96,53.18 LED2.2
$1N4664: length 57.7
  Top Layer w0.152: v1(58.84,61.64) 58.4,61.64 arc(57.94,61.25) 57.47,60.88 arc(36.04,53.56) 14.6,60.88 arc(12.5,62.75) 10.67,64.89 arc(10.55,65.06) 10.43,65.23 10.42,65.24 v1(9.64,65.24)
  Bottom Layer w0.152: 60.1,62.43 59.3,61.64 v1(58.84,61.64) ; 8.43,65.97 9.17,65.24 v1(9.64,65.24)
$1N4665: length 58
  Top Layer w0.152: v1(65.1,62.3) 65.1,61.55 arc(62.84,59.67) 60.88,57.47 arc(56.98,51.13) 54.5,44.11 arc(54.5,44.11) 54.5,44.1 v1(54.04,43.64)
  Bottom Layer w0.152: v1(65.1,62.3) 65.1,62.77 65.97,63.64 ; v1(54.04,43.64) 54.04,43.24 54.26,43.01 arc(54.25,42.94) 54.23,42.88 arc(54.49,28.02) 60.88,14.6 arc(61.26,14.12) 61.66,13.65 61.66,12.75 62.43,11.97
$1N4667: length 57.7
  Top Layer w0.152: v1(62.44,6.84) 61.65,6.84 61.64,6.84 arc(61.48,7.07) 61.31,7.29 arc(59.53,9.37) 57.47,11.19 arc(36.04,18.51) 14.6,11.19 arc(14.24,10.91) 13.88,10.61 arc(13.78,10.53) 13.68,10.44 v1(13.24,10.44)
  Bottom Layer w0.152: 11.97,9.64 12.77,10.44 v1(13.24,10.44) ; 63.64,6.1 62.9,6.84 v1(62.44,6.84)
$1N53848: length 3.8
  Top Layer w0.152: 38.1,26.13 40.35,26.13 40.73,26.51 41.73,26.51

## Copper pours and planes (outline as drawn; the poured copper is in the pictures)
1V8 on Top Layer: 42.21,45.18 41.88,44.85 41.88,43.66 42.13,43.4 45.89,43.4 46.2,43.71 46.2,44.82 45.84,45.18
3V3 on Top Layer: 37.8,32.35 36.92,31.47 36.92,28.54 37.49,27.98 39.6,27.98 40.47,28.84 40.47,31.77 39.89,32.35
3V3 on Top Layer: 42.49,49.5 42.08,49.09 42.08,48.02 41.72,47.66 40.65,47.66 40.3,47.32 40.3,46.14 39.34,45.18 38.27,45.18 38.17,45.08 38.17,44.52 38.27,44.42 39.49,44.42 39.74,44.16 39.74,41.93 40.3,41.37 40.3,37.87 40.55,37.62 41.48,37.62 41.74,37.88 41.74,44.82 41.74,44.89 42.23,45.38 44.84,45.38 45.04,45.59 45.04,47.14 44.82,47.36 44.13,47.36 43.71,47.79 43.71,49.08 43.73,49.09 43.32,49.5
5V on Top Layer: 33.24,47.47 33.14,47.36 33.14,46.55 33.24,46.45 34.92,46.45 35.32,46.04 35.32,43 34.66,42.33 34.66,41.54 34.37,41.24 32.15,41.24 31.87,40.96 31.87,39.48 32.15,39.2 33.66,39.2 34.36,39.9 36.89,39.9 37.37,40.38 37.37,46.26 37.56,46.45 38.88,46.45 38.98,46.55 38.98,47.36 38.88,47.47
GND on Top Layer: 76.04,76.04 76.04,-3.96 -3.96,-3.96 -3.96,76.04
GND on Bottom Layer: 76.04,76.04 76.04,-3.96 -3.96,-3.96 -3.96,76.04
VBAT on Top Layer: 18.37,46.94 18.06,46.31 18.52,45.29 19.29,45.07 20.29,45.31 21.48,44.55 21.46,43.05 19.92,41.51 19.92,40.46 20.16,40.23 24.61,40.23 25.37,39.46 27.02,39.46 27.4,39.85 27.4,46.32 26.86,46.87 20.38,47.3 19.58,47.3
(no net) on Top Layer: 20.51,23.56 24.17,23.56 24.17,19.3 20.51,19.3
$1N4621 on Top Layer: 29.84,48.89 36.44,48.89 36.59,48.74 36.59,48.08 36.49,47.97 30.24,47.97 29.58,47.31 29.58,46.96 29.43,46.81 28.42,46.81 28.31,46.91 28.31,47.36
$1N4622 on Top Layer: 28.46,45.6 28.31,45.46 28.31,44.9 28.54,44.67 28.54,39.97 28.92,39.59 30.32,39.59 30.45,39.72 30.45,41.75 31.84,43.15 33.62,43.15 33.88,43.4 33.88,44.8 33.62,45.05 30.11,45.05 29.56,45.6
$1N4634 on Top Layer: 24.77,55.42 23.97,54.96 22.74,50.36 17.49,48.74 17.24,47.97 17.49,47.21 18.23,46.96 19.99,47.53 25.37,49.12 26.56,54.36 26.29,54.94

Small or netless copper shapes (teardrops, artwork), in the pictures only: 229 on Top Layer, 100 on Bottom Layer

## Text on the board
Bottom Silkscreen Layer: 5V | GND | PB5 | PB4 | PB3 | PA15 | U1_TX | U1_RX | JLCJLCJLCJLC | VBAT | PA1 | U2_TX | U2_RX | SPI_SCK | SPI_MISO | SPI_MOSI | V | G | N | D | C
Top Silkscreen Layer: Y+ | X+ | Z+ | Designed by | OFF   ON | DreamFly | 梅雨
